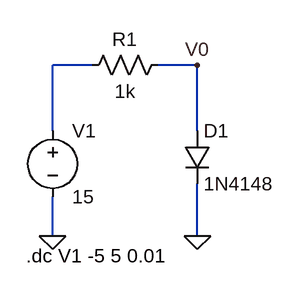
[diagram p0: schematic 1N4148.asc]
1N4148.asc, the LTspice schematic file:
Version 4
SHEET 1 880 680
WIRE 32 48 -16 48
WIRE 160 48 112 48
WIRE -16 128 -16 48
WIRE 160 128 160 48
WIRE -16 256 -16 208
WIRE 160 256 160 192
FLAG -16 256 0
FLAG 160 48 V0
FLAG 160 256 0
SYMBOL diode 144 128 R0
SYMATTR InstName D1
SYMATTR Value 1N4148
SYMBOL voltage -16 112 R0
WINDOW 123 0 0 Left 0
WINDOW 39 0 0 Left 0
SYMATTR InstName V1
SYMATTR Value 15
SYMBOL res 128 32 R90
WINDOW 0 0 56 VBottom 2
WINDOW 3 32 56 VTop 2
SYMATTR InstName R1
SYMATTR Value 1k
TEXT -48 280 Left 2 !.dc V1 -5 5 0.01

The netlist it stands for:
* 1N4148.asc
D1 V0 0 1N4148
V1 N001 0 15
R1 V0 N001 1k
.model D D
.lib standard.dio
.dc V1 -5 5 0.01
.backanno
.end

* Results of the author's LTspice run, read from the files saved beside the schematic
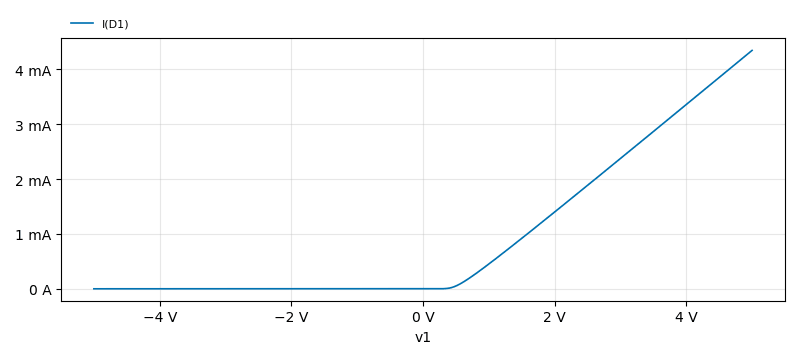
[diagram p1: DC transfer characteristic of 1N4148.asc, plotted from the saved traces]
* DC transfer characteristic, 1 run:
*   I(D1): -2.525 nA at v1=-5 V, 4.347 mA at v1=5 V, min -2.525 nA, max 4.347 mA